# Altium schematic sheet ADC.SchDoc
size A; SheetNumber: 3; SheetTotal: 4
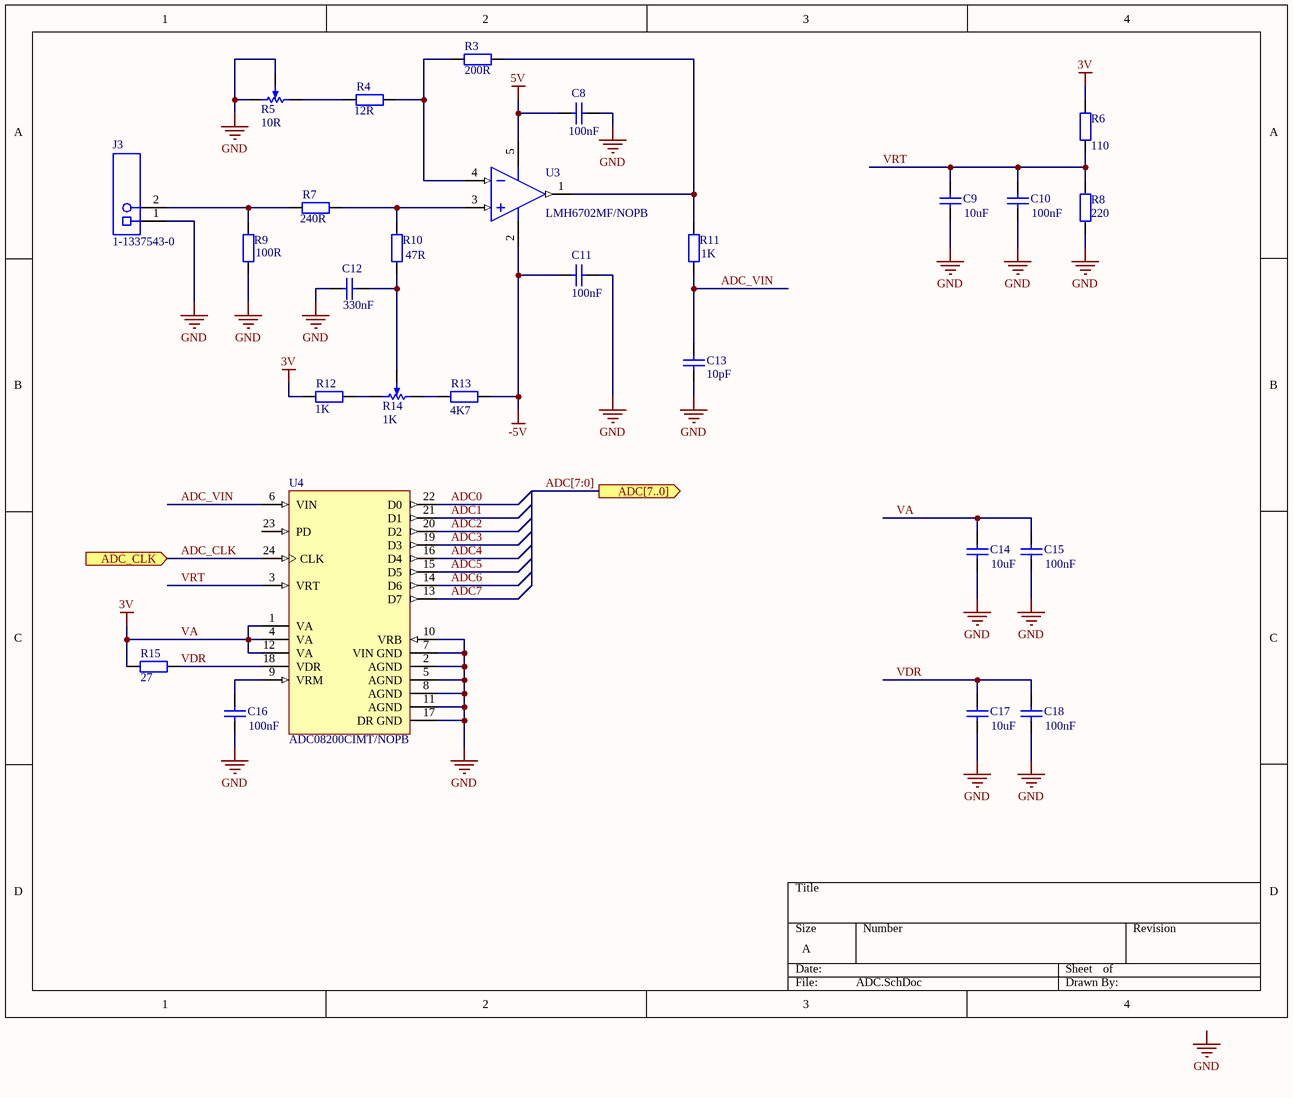
[diagram p0: ADC.SchDoc]

## Parts
C8  value 100nF  [RAD-0.3]  (hidden comment: Cap)
C9  value 10uF  [RAD-0.3]  (hidden comment: Cap)
C10  value 100nF  [RAD-0.3]  (hidden comment: Cap)
C11  value 100nF  [RAD-0.3]  (hidden comment: Cap)
C12  value 330nF  [RAD-0.3]  (hidden comment: Cap)
C13  value 10pF  [RAD-0.3]  (hidden comment: Cap)
C14  value 10uF  [RAD-0.3]  (hidden comment: Cap)
C15  value 100nF  [RAD-0.3]  (hidden comment: Cap)
C16  value 100nF  [RAD-0.3]  (hidden comment: Cap)
C17  value 10uF  [RAD-0.3]  (hidden comment: Cap)
C18  value 100nF  [RAD-0.3]  (hidden comment: Cap)
J3  1-1337543-0  [TECO-1-1337543-0_V]
R3  value 200R  [AXIAL-0.4]  (hidden comment: Res2)
R4  value 12R  [AXIAL-0.4]  (hidden comment: Res2)
R5  10R  [POT4MM-2]
R6  value 110  [AXIAL-0.4]  (hidden comment: Res2)
R7  value 240R  [AXIAL-0.4]  (hidden comment: Res2)
R8  value 220  [AXIAL-0.4]  (hidden comment: Res2)
R9  value 100R  [AXIAL-0.4]  (hidden comment: Res2)
R10  value 47R  [AXIAL-0.4]  (hidden comment: Res2)
R11  value 1K  [AXIAL-0.4]  (hidden comment: Res2)
R12  value 1K  [AXIAL-0.4]  (hidden comment: Res2)
R13  value 4K7  [AXIAL-0.4]  (hidden comment: Res2)
R14  1K  [POT4MM-2]
R15  value 27  [AXIAL-0.4]  (hidden comment: Res2)
U3  LMH6702MF/NOPB  [DBV0005A_N]
U4  ADC08200CIMT/NOPB  [PW0024A_M]

## Ports
ADC[7..0] (out), ADC_CLK (in)

## Nets
5V: C8.1 U3.5(V+)
-5V: C11.1 R13.1 U3.2(V-)
GND: C8.2 C9.1 C10.1 C11.2 C12.1 C13.1 C14.1 C15.1 C16.1 C17.1 C18.1 J3.1 R5.CW(+) R5.W R8.1 R9.1 U4.2(AGND) U4.5(AGND) U4.7(VIN_GND) U4.8(AGND) U4.10(VRB) U4.11(AGND) U4.17(DR_GND)
VA: C14.2 C15.2 R6.2 R12.2 R15.2 U4.1(VA) U4.4(VA) U4.12(VA)  [also labelled 3V]
ADC0: U4.22(D0)
ADC1: U4.21(D1)
ADC2: U4.20(D2)
ADC3: U4.19(D3)
ADC4: U4.16(D4)
ADC5: U4.15(D5)
ADC6: U4.14(D6)
ADC7: U4.13(D7)
ADC_CLK: U4.24(CLK) ; port ADC_CLK
ADC_VIN: C13.2 R11.1 U4.6(VIN)
VDR: C17.2 C18.2 R15.1 U4.18(VDR)
VRT: C9.2 C10.2 R6.1 R8.2 U4.3(VRT)
NetC12_2: C12.2 R10.1 R14.W
NetC16_2: C16.2 U4.9(VRM)
NetJ3_2: J3.2 R7.1 R9.2
NetR3_1: R3.1 R4.2 U3.4(IN-)
NetR3_2: R3.2 R11.2 U3.1(OUT)
NetR4_1: R4.1 R5.CCW(-)
NetR7_2: R7.2 R10.2 U3.3(IN+)
NetR12_1: R12.1 R14.CW(+)
NetR13_2: R13.2 R14.CCW(-)

Not connected (* = marked no-connect by the designer): U4 23(PD)

## Buses and harness runs
bus ADC[7:0] = port ADC[7..0]

## Notes on the sheet
- Labels drawn without touching a wire or pin: GND

## Library data of the parts
C8-C18 = Cap: Capacitor; Published: 8-Jun-2000; LatestRevisionDate: 17-Jul-2002; LatestRevisionNote: Re-released for DXP Platform.; PackageReference: RAD-0.3; Publisher: Altium Limited; PackageDescription: Radial Cap, Thru-Hole; 2 Leads; 0.3 in Pin Spacing
J3 = CMP-2000-05853-1: Female Connector, Pitch 2.54 mm, 1 x 2 Position, Height 15.8 mm, Tail Length 3.8 mm, / -55 to 85 degC, RoHS, Bulk; Manufacturer: TE Connectivity; Connector Body Style: RightAngleJack; Frequency Max: 4GHz; Coaxial Termination: Solder; Connector Mounting: PCBMount; SVHC: ToBeAdvised; Connector Type: BNCCoaxial; Impedance: 50ohm; Coaxial Cable Types: -; Manufacturer URL: http://www.te.com/; Package Reference: 1-1337543-0; Product Range: -; Datasheet URL: http://www.te.com/commerce/DocumentDelivery/DDEController?Action=showdoc&DocId=Customer+Drawing%7F1337543%7FG%7Fpdf%7FEnglish%7FENG_CD_1337543_G.pdf%7F1-1337543-0; Contact Plating: GoldPlatedContacts; Mounting Technology: ThroughHole; Package Description: Female Connector, Pitch 2.54 mm, 1 x 2 Position, Height 15.8 mm, Tail Length 3.8 mm; Contact Material: Brass; Datasheet Version: Rev. G, 12/2012
R3 R4 R6-R13 R15 = Res2: Resistor; Published: 8-Jun-2000; LatestRevisionDate: 17-Jul-2002; LatestRevisionNote: Re-released for DXP Platform.; PackageReference: AXIAL-0.4; Publisher: Altium Limited; PackageDescription: Axial Device, Thru-Hole; 2 Leads; 0.4 in Pin Spacing
R5 R14 = RPot SM: Square Trimming Potentiometer; Published: 17-Dec-2003; DatasheetVersion: Oct-2003; PackageReference: POT4MM-2; Publisher: Altium Limited; PackageDescription: Square Trimming Potentiometer; ComponentLink1Description: Manufacturer Link; ComponentLink1URL: http://bourns.com/2/search.html
U3 = CMP-0055-01272-3: 1.7 GHz, Ultra Low Distortion, Wideband Op Amp, 5-pin SOT-23, Pb-Free; Manufacturer: Texas Instruments; CompType: Amplifiers; PackageTopMarking: A83A*XTT; PowerWise: Y; Package Reference: DBV0005A; RoHS: Y; ComponentLink1Description: Datasheet URL; PackageDescription: Molded SOT-23, .115 x .063 x .040 in Body, 5 Lead, .0375 in Pitch; PinCount: 5; ComponentLink1URL: http://www.ti.com/general/docs/lit/getliterature.tsp?genericPartNumber=LMH6702&fileType=pdf
U4 = CMP-0054-00424-3: 8-Bit, 20 MSPS to 200 MSPS, Low Power A/D Converter with Internal Sample-and-Hold, 24-pin TSSOP, Pb-Free; Manufacturer: Texas Instruments; PowerWise: N; CompType: ADC IC; PackageTopMarking: NSUZXYTTE#*ADC08200*CIMT; Code_JEDEC: MO-153-AD; ComponentLink1URL: http://www.ti.com/general/docs/lit/getliterature.tsp?genericPartNumber=ADC08200&fileType=pdf; PackageDescription: Molded TSSOP, Jedec, 7.8 x 4.4 x 0.9mm Body, 24 Lead, 0.65mm Pitch; RoHS: Y; PackageReference: PW0024A; PinCount: 24; ComponentLink1Description: Datasheet URL